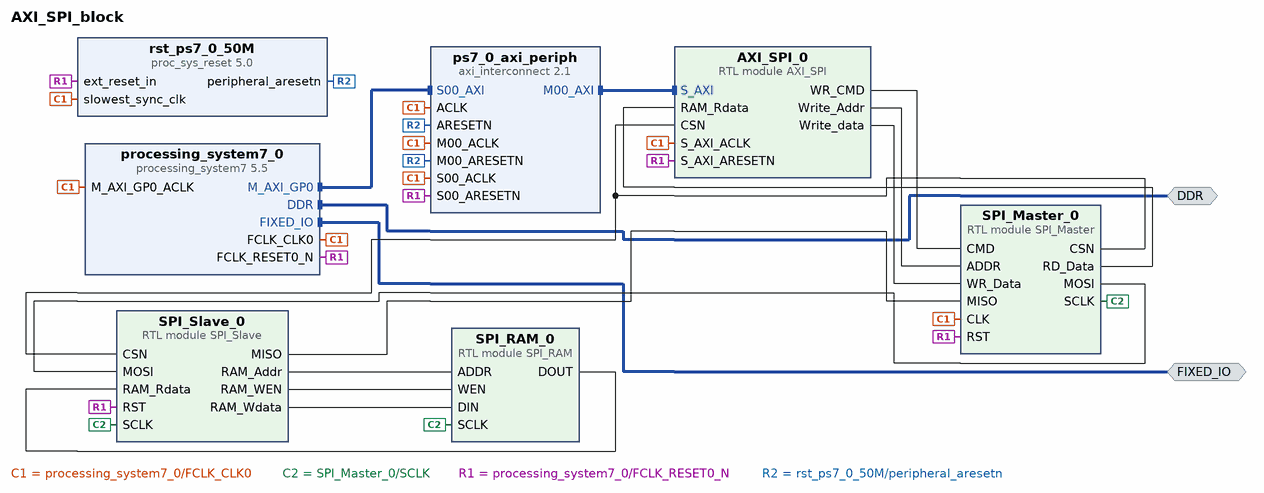
[diagram p0: block diagram of the top level]
# Vivado block design AXI_SPI_block, xc7z007sclg400-1, Vivado 2023.2
create_bd_design AXI_SPI_block

create_bd_intf_port -mode Master -vlnv xilinx.com:interface:ddrx_rtl:1.0 DDR
create_bd_intf_port -mode Master -vlnv xilinx.com:display_processing_system7:fixedio_rtl:1.0 FIXED_IO

create_bd_cell -type ip -vlnv xilinx.com:ip:processing_system7:5.5 processing_system7_0
set_property -dict [list \
  CONFIG.PCW_APU_PERIPHERAL_FREQMHZ 650 \
  CONFIG.PCW_CRYSTAL_PERIPHERAL_FREQMHZ 50 \
  CONFIG.PCW_ENET0_ENET0_IO {MIO 16 .. 27} \
  CONFIG.PCW_ENET0_GRP_MDIO_ENABLE 1 \
  CONFIG.PCW_ENET0_GRP_MDIO_IO {MIO 52 .. 53} \
  CONFIG.PCW_ENET0_PERIPHERAL_ENABLE 1 \
  CONFIG.PCW_ENET0_RESET_ENABLE 1 \
  CONFIG.PCW_ENET0_RESET_IO {MIO 9} \
  CONFIG.PCW_ENET_RESET_ENABLE 1 \
  CONFIG.PCW_ENET_RESET_SELECT {Share reset pin} \
  CONFIG.PCW_FPGA0_PERIPHERAL_FREQMHZ 100 \
  CONFIG.PCW_GPIO_MIO_GPIO_ENABLE 1 \
  CONFIG.PCW_GPIO_MIO_GPIO_IO MIO \
  CONFIG.PCW_I2C_RESET_ENABLE 1 \
  CONFIG.PCW_PRESET_BANK1_VOLTAGE {LVCMOS 1.8V} \
  CONFIG.PCW_QSPI_PERIPHERAL_ENABLE 0 \
  CONFIG.PCW_SD0_GRP_CD_ENABLE 1 \
  CONFIG.PCW_SD0_GRP_CD_IO {MIO 47} \
  CONFIG.PCW_SD0_GRP_WP_ENABLE 0 \
  CONFIG.PCW_SD0_PERIPHERAL_ENABLE 1 \
  CONFIG.PCW_SD0_SD0_IO {MIO 40 .. 45} \
  CONFIG.PCW_SDIO_PERIPHERAL_FREQMHZ 100 \
  CONFIG.PCW_UART0_PERIPHERAL_ENABLE 1 \
  CONFIG.PCW_UART0_UART0_IO {MIO 14 .. 15} \
  CONFIG.PCW_UART_PERIPHERAL_FREQMHZ 100 \
  CONFIG.PCW_UIPARAM_DDR_BUS_WIDTH {16 Bit} \
  CONFIG.PCW_UIPARAM_DDR_FREQ_MHZ 525 \
  CONFIG.PCW_UIPARAM_DDR_PARTNO {MT41K256M16 RE-125} \
  CONFIG.PCW_USB0_PERIPHERAL_ENABLE 1 \
  CONFIG.PCW_USB0_RESET_ENABLE 1 \
  CONFIG.PCW_USB0_RESET_IO {MIO 46} \
  CONFIG.PCW_USB0_USB0_IO {MIO 28 .. 39} \
  CONFIG.PCW_USB_RESET_ENABLE 1 \
  CONFIG.PCW_USB_RESET_SELECT {Share reset pin} \
] [get_bd_cells processing_system7_0]
# 293 more settings of processing_system7_0 are not shown: defaults, MIO pin electricals, DDR timing, and values the tool derives
create_bd_cell -type module -reference AXI_SPI AXI_SPI_0
create_bd_cell -type module -reference SPI_Master SPI_Master_0
create_bd_cell -type module -reference SPI_Slave SPI_Slave_0
create_bd_cell -type module -reference SPI_RAM SPI_RAM_0
create_bd_cell -type ip -vlnv xilinx.com:ip:axi_interconnect:2.1 ps7_0_axi_periph
set_property -dict {CONFIG.NUM_MI 1} [get_bd_cells ps7_0_axi_periph]
create_bd_cell -type ip -vlnv xilinx.com:ip:proc_sys_reset:5.0 rst_ps7_0_50M

# ---- connections ----

connect_bd_intf_net [get_bd_intf_ports DDR] [get_bd_intf_pins processing_system7_0/DDR]
connect_bd_intf_net [get_bd_intf_ports FIXED_IO] [get_bd_intf_pins processing_system7_0/FIXED_IO]
connect_bd_intf_net [get_bd_intf_pins processing_system7_0/M_AXI_GP0] [get_bd_intf_pins ps7_0_axi_periph/S00_AXI]
connect_bd_intf_net [get_bd_intf_pins ps7_0_axi_periph/M00_AXI] [get_bd_intf_pins AXI_SPI_0/S_AXI]
connect_bd_net [get_bd_pins AXI_SPI_0/WR_CMD] [get_bd_pins SPI_Master_0/CMD]
connect_bd_net [get_bd_pins AXI_SPI_0/Write_Addr] [get_bd_pins SPI_Master_0/ADDR]
connect_bd_net [get_bd_pins AXI_SPI_0/Write_data] [get_bd_pins SPI_Master_0/WR_Data]
connect_bd_net [get_bd_pins processing_system7_0/FCLK_CLK0] \
  [get_bd_pins processing_system7_0/M_AXI_GP0_ACLK] [get_bd_pins ps7_0_axi_periph/S00_ACLK] \
  [get_bd_pins ps7_0_axi_periph/M00_ACLK] [get_bd_pins rst_ps7_0_50M/slowest_sync_clk] [get_bd_pins ps7_0_axi_periph/ACLK] \
  [get_bd_pins SPI_Master_0/CLK] [get_bd_pins AXI_SPI_0/S_AXI_ACLK]
connect_bd_net [get_bd_pins SPI_Master_0/CSN] [get_bd_pins SPI_Slave_0/CSN] [get_bd_pins AXI_SPI_0/CSN]
connect_bd_net [get_bd_pins SPI_Master_0/MOSI] [get_bd_pins SPI_Slave_0/MOSI]
connect_bd_net [get_bd_pins SPI_Master_0/RD_Data] [get_bd_pins AXI_SPI_0/RAM_Rdata]
connect_bd_net [get_bd_pins SPI_Master_0/SCLK] [get_bd_pins SPI_Slave_0/SCLK] [get_bd_pins SPI_RAM_0/SCLK]
connect_bd_net [get_bd_pins SPI_RAM_0/DOUT] [get_bd_pins SPI_Slave_0/RAM_Rdata]
connect_bd_net [get_bd_pins SPI_Slave_0/MISO] [get_bd_pins SPI_Master_0/MISO]
connect_bd_net [get_bd_pins SPI_Slave_0/RAM_Addr] [get_bd_pins SPI_RAM_0/ADDR]
connect_bd_net [get_bd_pins SPI_Slave_0/RAM_WEN] [get_bd_pins SPI_RAM_0/WEN]
connect_bd_net [get_bd_pins SPI_Slave_0/RAM_Wdata] [get_bd_pins SPI_RAM_0/DIN]
connect_bd_net [get_bd_pins processing_system7_0/FCLK_RESET0_N] \
  [get_bd_pins ps7_0_axi_periph/S00_ARESETN] [get_bd_pins rst_ps7_0_50M/ext_reset_in] [get_bd_pins SPI_Slave_0/RST] \
  [get_bd_pins SPI_Master_0/RST] [get_bd_pins AXI_SPI_0/S_AXI_ARESETN]
connect_bd_net [get_bd_pins rst_ps7_0_50M/peripheral_aresetn] [get_bd_pins ps7_0_axi_periph/M00_ARESETN] [get_bd_pins ps7_0_axi_periph/ARESETN]

# ---- address map ----
assign_bd_address -offset 0x40000000 -range 4K -target_address_space [get_bd_addr_spaces processing_system7_0/Data] [get_bd_addr_segs AXI_SPI_0/S_AXI/reg0]

validate_bd_design
save_bd_design
